# EAGLE schematic SAM3U_Test_Schematic (EAGLE 6.4)
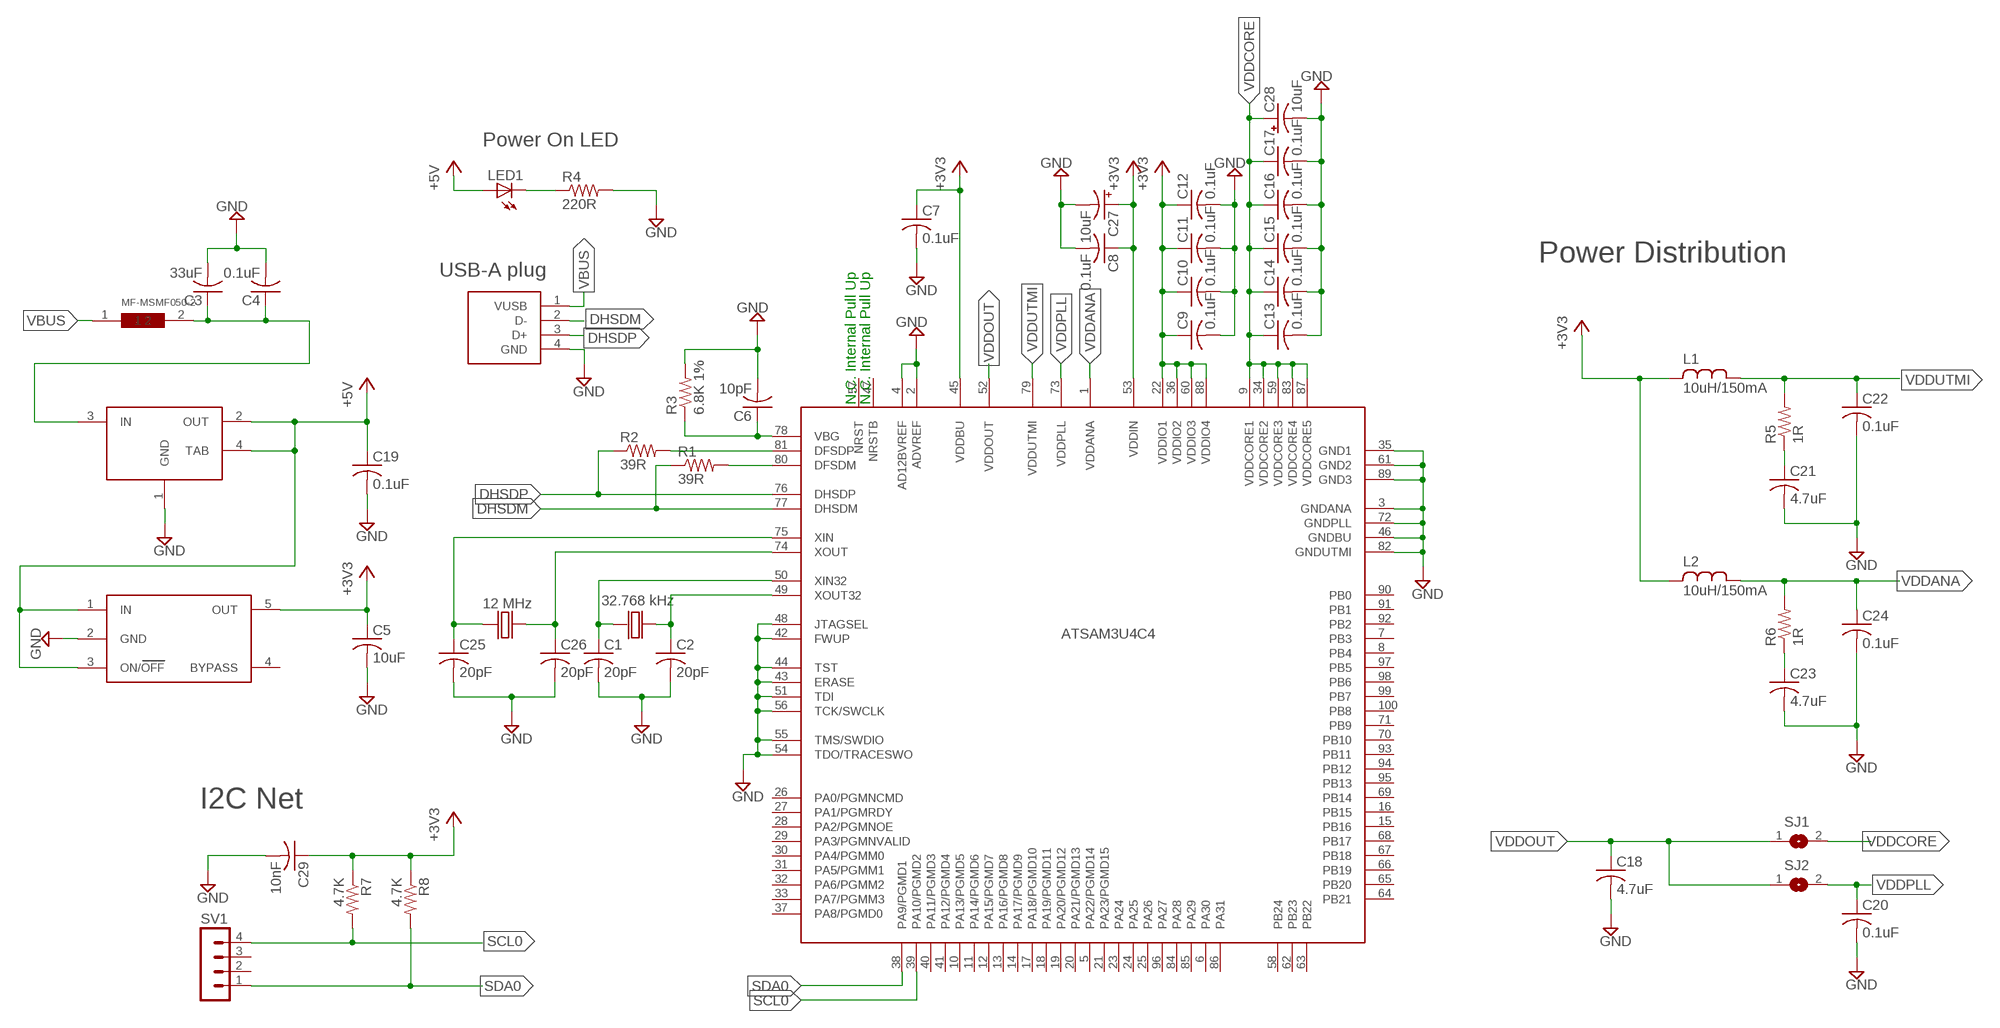
[diagram p0: schematic, sheet 1]

## Parts
C1  20pF  C-USC0402K  [C0402K]
C2  20pF  C-USC0402K  [C0402K]
C3  33uF  C-USC0805K  [C0805K]
C4  0.1uF  C-USC0402K  [C0402K]
C5  10uF  C-USC0402K  [C0402K]
C6  10pF  C-USC0402K  [C0402K]
C7  0.1uF  C-USC0402K  [C0402K]
C8  0.1uF  C-USC0402K  [C0402K]
C9  0.1uF  C-USC0402K  [C0402K]
C10  0.1uF  C-USC0402K  [C0402K]
C11  0.1uF  C-USC0402K  [C0402K]
C12  0.1uF  C-USC0402K  [C0402K]
C13  0.1uF  C-USC0402K  [C0402K]
C14  0.1uF  C-USC0402K  [C0402K]
C15  0.1uF  C-USC0402K  [C0402K]
C16  0.1uF  C-USC0402K  [C0402K]
C17  0.1uF  C-USC0402K  [C0402K]
C18  4.7uF  C-USC0402K  [C0402K]
C19  0.1uF  C-USC0402K  [C0402K]
C20  0.1uF  C-USC0402K  [C0402K]
C21  4.7uF  C-USC0402K  [C0402K]
C22  0.1uF  C-USC0402K  [C0402K]
C23  4.7uF  C-USC0402K  [C0402K]
C24  0.1uF  C-USC0402K  [C0402K]
C25  20pF  C-USC0402K  [C0402K]
C26  20pF  C-USC0402K  [C0402K]
C27  10uF  CPOL-USA/3216-18R  [A/3216-18R]
C28  10uF  CPOL-USA/3216-18R  [A/3216-18R]
C29  10nF  C-USC0402K  [C0402K]
L1  TDK_MLZ2012_INDUCTOR  [TDK_MLZ_INDUCTOR_2012PACK]
L2  TDK_MLZ2012_INDUCTOR  [TDK_MLZ_INDUCTOR_2012PACK]
LED1  LEDCHIPLED_0603  [CHIPLED_0603]
R1  39R  R-US_R0402  [R0402]
R2  39R  R-US_R0402  [R0402]
R3  6.8K 1%  R-US_R0402  [R0402]
R4  220R  R-US_R0402  [R0402]
R5  1R  R-US_R0402  [R0402]
R6  1R  R-US_R0402  [R0402]
R7  4.7K  R-US_R0402  [R0402]
R8  4.7K  R-US_R0402  [R0402]
SJ1  SJ  [SJ]
SJ2  SJ  [SJ]
SV1  MA04-1  [MA04-1]
U$1  USB_TYPE_A_KEYSTN  [USB_TYPE_PLUG_KSTN_PACK]
U$2  ATSAM3UC4-PA  [QFP50P1600X1600X160-100N]
U$3  32678_KYOCERA  [32678_KYOCERA_PACK]
U$4  MF-MSMF050-2  [MF-MSMF050-PACK]
U$5  NCP1117-55V  [NCP1117-5-SOT]
U$6  LP2985-33DBVR5-PIN  [LP2985-33DBVR-SO]
U$7  AVX_12MHZ_CRYSTAL_CX3225GB  [AVX_12MHZ_CX3225GB_PACK]

## Nets
+3V3: C5.1 C7.1 C8.1 C9.1 C10.1 C11.1 C12.1 C27.+ C29.1 L1.1 L2.1 R7.1 R8.1 U$2.22(VDDIO1) U$2.36(VDDIO2) U$2.45(VDDBU) U$2.53(VDDIN) U$2.60(VDDIO3) U$2.88(VDDIO4) U$6.5(OUT)
+5V: C19.1 LED1.A U$5.2(OUT) U$5.4(TAB) U$6.1(IN) U$6.3(ON/OFF)
DFSDM: R1.2 U$2.80(DFSDM)
DHSDM: R1.1 U$1.2(D-) U$2.77(DHSDM)
DHSDP: R2.1 U$1.3(D+) U$2.76(DHSDP)
GND: C1.2 C2.2 C3.2 C4.2 C5.2 C6.2 C7.2 C8.2 C9.2 C10.2 C11.2 C12.2 C13.2 C14.2 C15.2 C16.2 C17.2 C18.2 C19.2 C20.2 C21.2 C22.2 C23.2 C24.2 C25.2 C26.2 C27.- C28.- C29.2 R3.2 R4.2 U$1.4(GND) U$2.2(ADVREF) U$2.3(GNDANA) U$2.4(AD12BVREF) U$2.35(GND1) U$2.42(FWUP) U$2.43(ERASE) U$2.44(TST) U$2.46(GNDBU) U$2.48(JTAGSEL) U$2.51(TDI) U$2.54(TDO/TRACESWO) U$2.55(TMS/SWDIO) U$2.56(TCK/SWCLK) U$2.61(GND2) U$2.72(GNDPLL) U$2.82(GNDUTMI) U$2.89(GND3) U$5.1(GND) U$6.2(GND)
N$1: C2.1 U$2.49(XOUT32) U$3.2
N$2: C1.1 U$2.50(XIN32) U$3.1
N$3: C26.1 U$2.74(XOUT) U$7.3
N$4: R2.2 U$2.81(DFSDP)
N$5: C3.1 C4.1 U$4.2 U$5.3(IN)
N$6: LED1.C R4.1
N$7: C21.1 R5.1
N$8: C23.1 R6.1
N$9: C25.1 U$2.75(XIN) U$7.1
SCL0: R7.2 SV1.4 U$2.39(PA10/PGMD2)
SDA0: R8.2 SV1.1 U$2.38(PA9/PGMD1)
VBG: C6.1 R3.1 U$2.78(VBG)
VBUS: U$1.1(VUSB) U$4.1
VDDANA: C24.1 L2.2 R6.2 U$2.1(VDDANA)
VDDCORE: C13.1 C14.1 C15.1 C16.1 C17.1 C28.+ SJ1.2 U$2.9(VDDCORE1) U$2.34(VDDCORE2) U$2.59(VDDCORE3) U$2.83(VDDCORE4) U$2.87(VDDCORE5)
VDDOUT: C18.1 SJ1.1 SJ2.1 U$2.52(VDDOUT)
VDDPLL: C20.1 SJ2.2 U$2.73(VDDPLL)
VDDUTMI: C22.1 L1.2 R5.2 U$2.79(VDDUTMI)
Unconnected: SV1.2 SV1.3 U$2.5(PA22/PGMD14) U$2.6(PA30) U$2.7(PB3) U$2.8(PB4) U$2.10(PA13/PGMD5) U$2.11(PA14/PGMD6) U$2.12(PA15/PGMD7) U$2.13(PA16/PGMD8) U$2.14(PA17/PGMD9) U$2.15(PB16) U$2.16(PB15) U$2.17(PA18/PGMD10) U$2.18(PA19/PGMD11) U$2.19(PA20/PGMD12) U$2.20(PA21/PGMD13) U$2.21(PA23/PGMD15) U$2.23(PA24) U$2.24(PA25) U$2.25(PA26) U$2.26(PA0/PGMNCMD) U$2.27(PA1/PGMRDY) U$2.28(PA2/PGMNOE) U$2.29(PA3/PGMNVALID) U$2.30(PA4/PGMM0) U$2.31(PA5/PGMM1) U$2.32(PA6/PGMM2) U$2.33(PA7/PGMM3) U$2.37(PA8/PGMD0) U$2.40(PA11/PGMD3) U$2.41(PA12/PGMD4) U$2.47(NRSTB) U$2.57(NRST) U$2.58(PB24) U$2.62(PB23) U$2.63(PB22) U$2.64(PB21) U$2.65(PB20) U$2.66(PB19) U$2.67(PB18) U$2.68(PB17) U$2.69(PB14) U$2.70(PB10) U$2.71(PB9) U$2.84(PA28) U$2.85(PA29) U$2.86(PA31) U$2.90(PB0) U$2.91(PB1) U$2.92(PB2) U$2.93(PB11) U$2.94(PB12) U$2.95(PB13) U$2.96(PA27) U$2.97(PB5) U$2.98(PB6) U$2.99(PB7) U$2.100(PB8) U$6.4(BYPASS)

## Notes on the sheet
- Power On LED
- Power Distribution
- USB-A plug
- L1
- 10uH/150mA
- N.C. Internal Pull Up | N.C. Internal Pull Up
- L2
- 10uH/150mA
- 12 MHz | 32.768 kHz
- I2C Net

## Library data of the parts
C1-C26 C29 = rcl:C-US: CAPACITOR, American symbol
C27 C28 = rcl:CPOL-US: POLARIZED CAPACITOR, American symbol
L1 L2 = ic_inductor_pa:TDK_MLZ2012_INDUCTOR: Pegasus Aero representation of MLZ2012 Inductor
LED1 = led:LED: LED OSRAM: - CHIPLED LG R971, LG N971, LY N971, LG Q971, LY Q971, LO R971, LY R971 LH N974, LH R974 LS Q976, LO Q976, LY Q976 LO Q996 - Hyper CHIPLED LW Q18S LB Q993, LB Q99A, LB R99A - SideLED LS A670, LO A670, LY A670, LG A670, LP A670 LB A673, LV A673, LT A673, LW A673 LH A674 LY A675 LS A676, LA A676, LO A676, LY A676, LW A676 LS A679, LY A679, LG A679 - Hyper Micro SIDELED® LS Y876, LA Y876, LO Y876, LY Y876 LT Y87S - SmartLED LW L88C, LW L88S LB L89C, LB L89S, LG L890 LS L89K, LO L89K, LY L89K LS L896, LA L896, LO L896, LY L896 - TOPLED LS T670, LO T670, LY T670, LG T670, LP T670 LSG T670, LSP T670, LSY T670, LOP T670, LYG T670 LG T671, LOG T671, LSG T671 LB T673, LV T673, LT T673, LW T673 LH T674 LS T676, LA T676, LO T676, LY T676, LB T676, LH T676, LSB T676, LW T676 LB T67C, LV T67C, LT T67C, LS T67K, LO T67K, LY T67K, LW E67C LS E67B, LA E67B, LO E67B, LY E67B, LB E67C, LV E67C, LT E67C LW T67C LS T679, LY T679, LG T679 LS T770, LO T770, LY T770, LG T770, LP T770 LB T773, LV T773, LT T773, LW T773 LH T774 LS E675, LA E675, LY E675, LS T675 LS T776, LA T776, LO T776, LY T776, LB T776 LHGB T686 LT T68C, LB T68C - Hyper Mini TOPLED® LB M676 - Mini TOPLED Santana® LG M470 LS M47K, LO M47K, LY M47K Source: http://www.osram.convergy.de LUXEON: - LUMILED® LXK2-PW12-R00, LXK2-PW12-S00, LXK2-PW14-U00, LXK2-PW14-V00 LXK2-PM12-R00, LXK2-PM12-S00, LXK2-PM14-U00 LXK2-PE12-Q00, LXK2-PE12-R00, LXK2-PE12-S00, LXK2-PE14-T00, LXK2-PE14-U00 LXK2-PB12-K00, LXK2-PB12-L00, LXK2-PB12-M00, LXK2-PB14-N00, LXK2-PB14-P00, LXK2-PB14-Q00 LXK2-PR12-L00, LXK2-PR12-M00, LXK2-PR14-Q00, LXK2-PR14-R00 LXK2-PD12-Q00, LXK2-PD12-R00, LXK2-PD12-S00 LXK2-PH12-R00, LXK2-PH12-S00 LXK2-PL12-P00, LXK2-PL12-Q00, LXK2-PL12-R00 Source: www.luxeon.com KINGBRIGHT: KA-3528ASYC Source: www.kingbright.com
R1-R8 = rcl:R-US_: RESISTOR, American symbol
SJ1 SJ2 = jumper:SJ: SMD solder JUMPER
SV1 = con-lstb:MA04-1: PIN HEADER; OC_FARNELL: unknown; OC_NEWARK: unknown
U$1 = ic_usb_typeA_connector_pa:USB_TYPE_A_KEYSTN: Pegasus Aero representation of USB type A plug from Keystone Electronics
U$2 = Atmel_By_element14_Batch_1:ATSAM3UC4-PA: Pegasus Aero representation of ATSAM3U4C4
U$3 = ic_crystal_pa:32678_KYOCERA: ST3215SB32768H5HPWAA
U$4 = ic_mf-msmf050_pa:MF-MSMF050-2: Pegasus Aero representation of MF-MSMF050-2 Bourns resettable fuse
U$5 = ic_voltage_reg_pa:NCP1117-5: Pegasus Aero representation of NCP-1117-5
U$6 = ic_voltage_reg_pa:LP2985-33DBVR: Pegasus Aero representation of Texas Instruments LP2985-DBVR
U$7 = ic_crystal_pa:AVX_12MHZ_CRYSTAL_CX3225GB: AVX KYOCERA 12 MHZ crystal CX3225GB